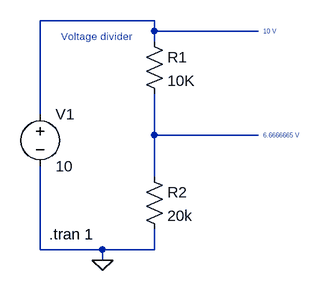
[diagram p0: schematic sch.asc]
sch.asc, the LTspice schematic file:
Version 4
SHEET 1 880 680
WIRE 128 -48 -48 -48
WIRE 128 -32 128 -48
WIRE 288 -32 128 -32
WIRE 128 -16 128 -32
WIRE -48 96 -48 -48
WIRE 128 128 128 64
WIRE 288 128 128 128
WIRE 128 192 128 128
WIRE -48 304 -48 176
WIRE 48 304 -48 304
WIRE 128 304 128 272
WIRE 128 304 48 304
WIRE 48 320 48 304
FLAG 48 320 0
SYMBOL res 112 -32 R0
SYMATTR InstName R1
SYMATTR Value 10K
SYMBOL res 112 176 R0
SYMATTR InstName R2
SYMATTR Value 20k
SYMBOL voltage -48 80 R0
WINDOW 123 0 0 Left 0
WINDOW 39 0 0 Left 0
SYMATTR InstName V1
SYMATTR Value 10
TEXT -16 -24 Left 1 ;Voltage divider
TEXT -34 280 Left 2 !.tran 1
TEXT 296 -32 Left 0 ;10 V
TEXT 296 128 Left 0 ;6.6666665 V

The netlist it stands for:
* sch.asc
R1 N001 N002 10K
R2 N002 0 20k
V1 N001 0 10
* Voltage divider
.tran 1
* 10 V
* 6.6666665 V
.backanno
.end